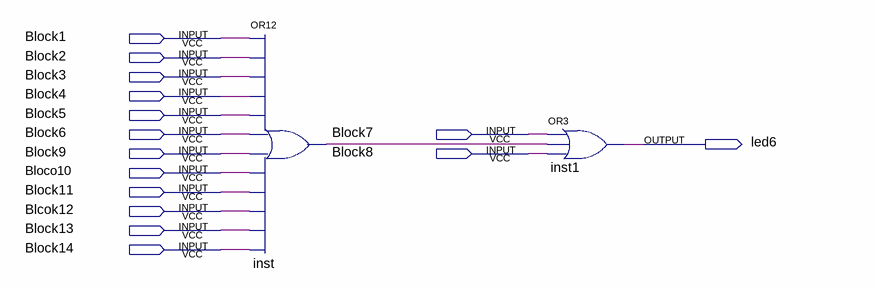
[diagram p0: schematic sheet]
// Quartus schematic Block15.bdf as structural Verilog: 2 symbols, 15 pins
module Block15 (
  input  Block1,
  input  Block2,
  input  Block3,
  input  Block4,
  input  Block5,
  input  Block6,
  input  Block7,
  input  Block9,
  input  Block8,
  input  Bloco10,
  input  Block11,
  input  Blcok12,
  input  Block13,
  input  Block14,
  output led6
);

  wire inst_out;

  or inst (inst_out, Block1, Block2, Block3, Block4, Block5, Block6, Block9, Bloco10, Block11, Blcok12, Block13, Block14);
  or inst1 (led6, Block7, inst_out, Block8);
endmodule
